# Altium project Project_1_Special_Strings.PrjPcb
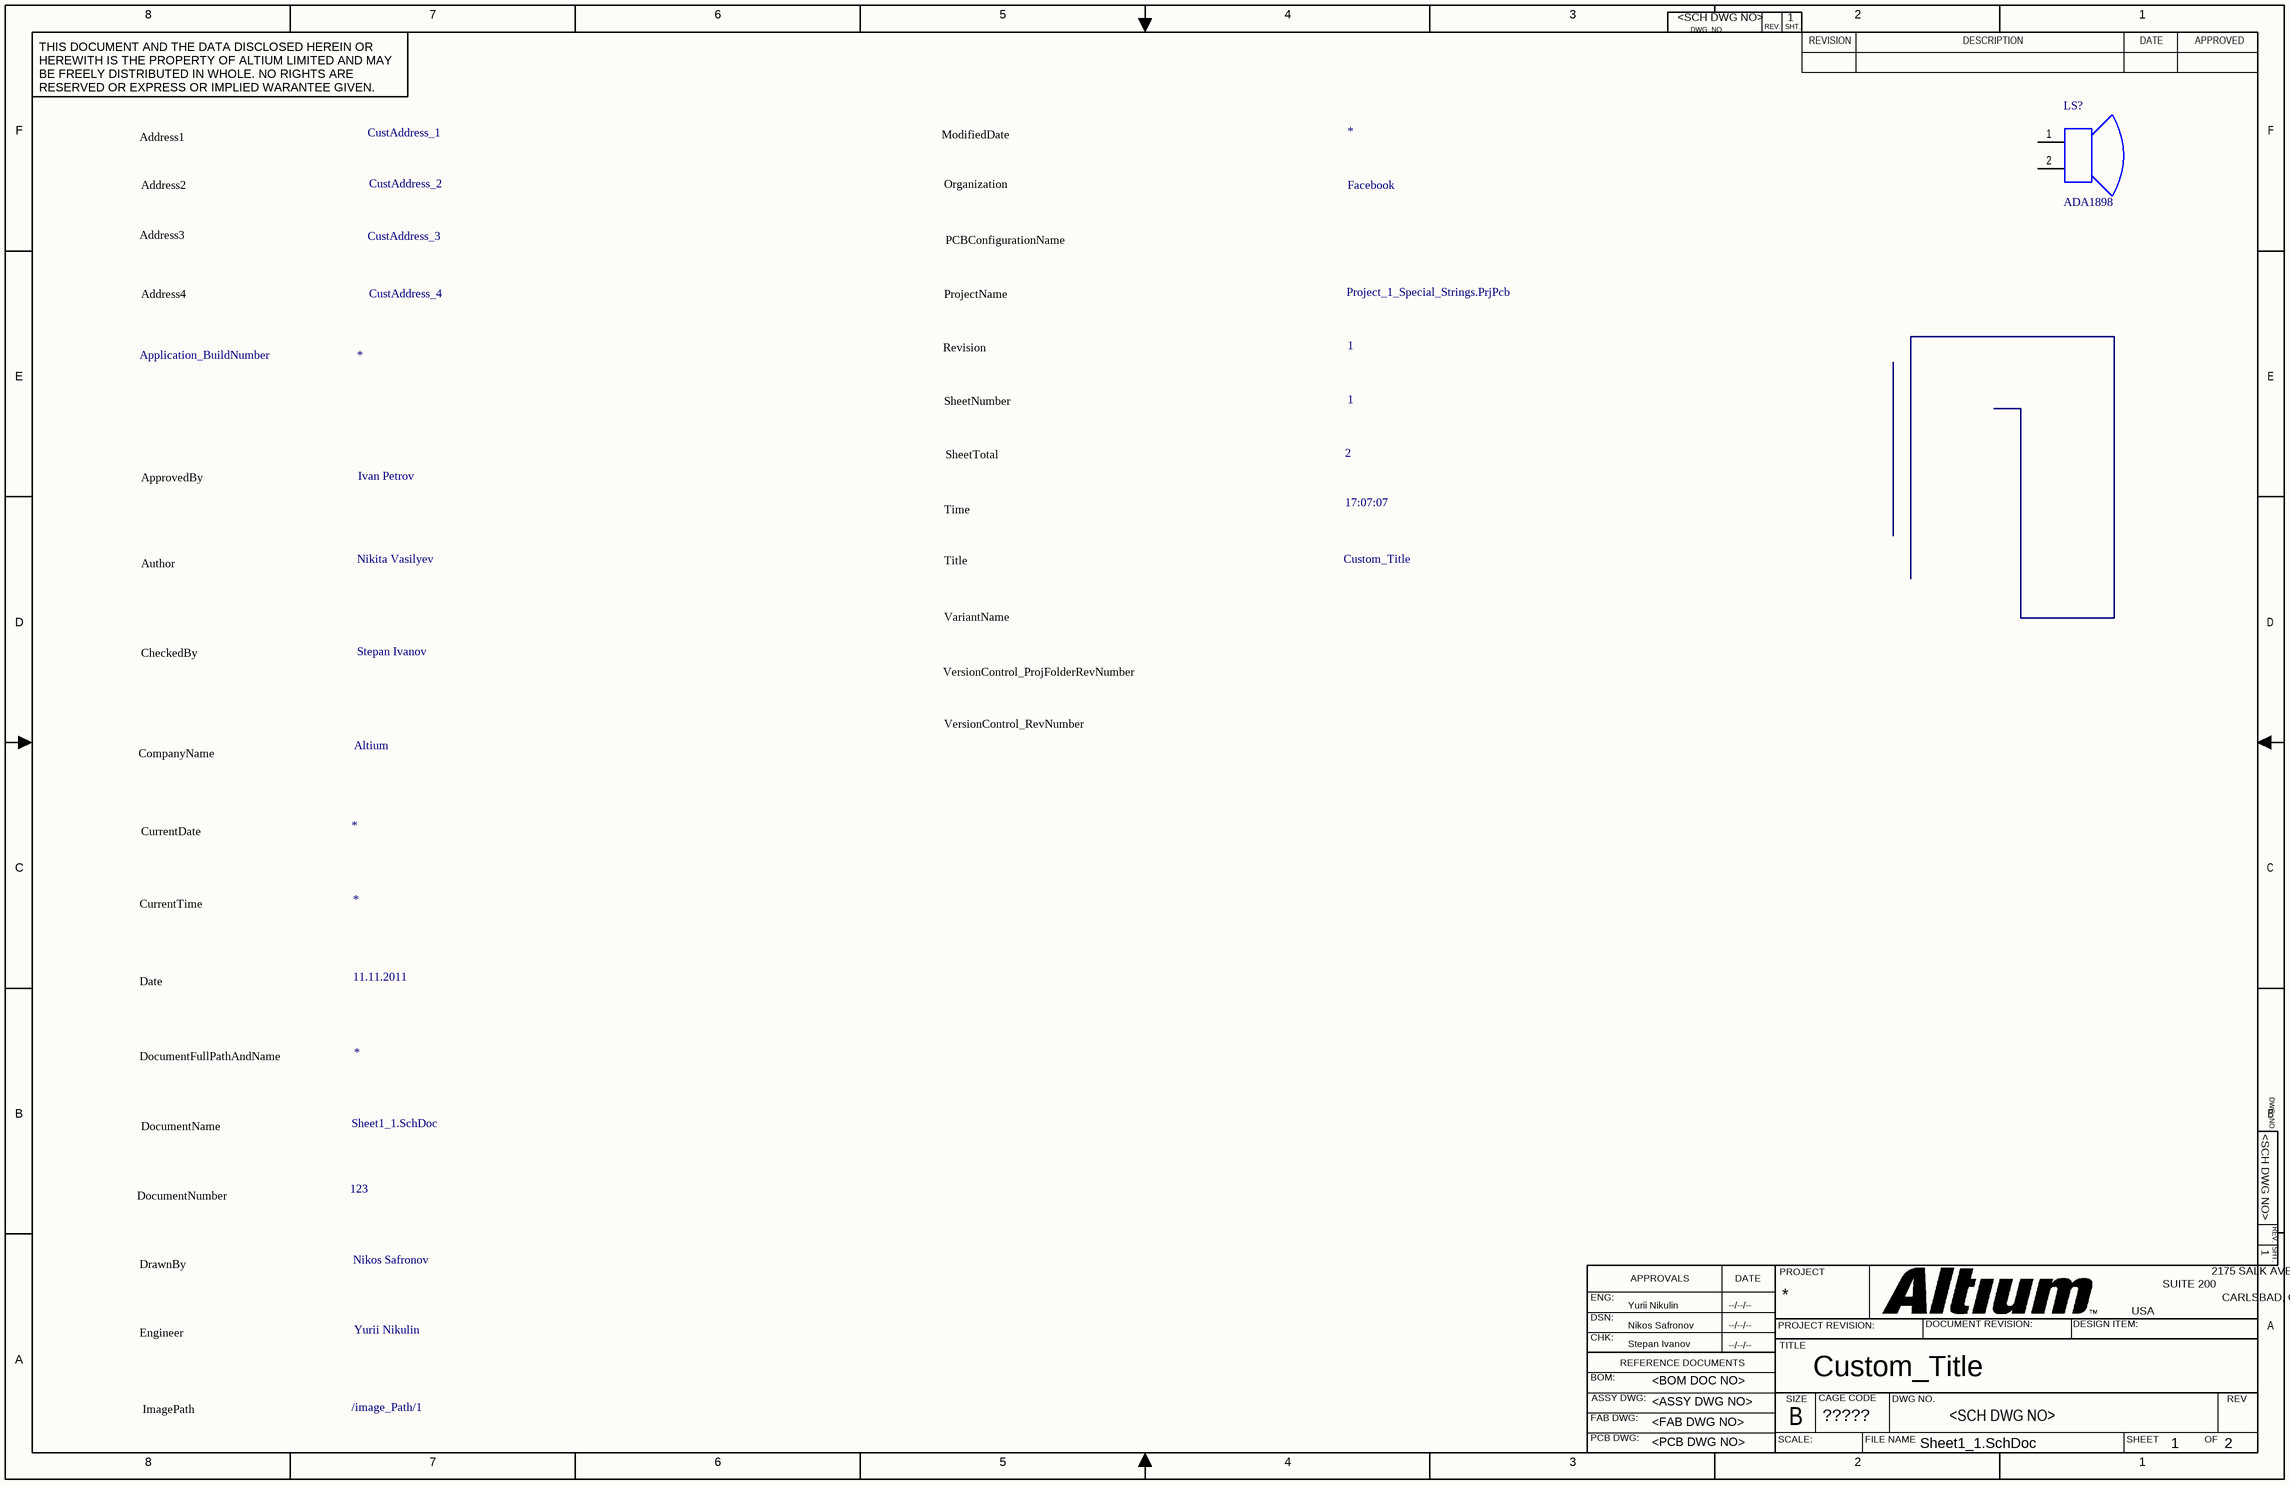
[diagram p0: Sheet1_1.SchDoc]
CAGE_CODE: ?????; CONTRACT_NUMBER: <CONTRACT NO>; DOC_NO_ASSY_DWG: <ASSY DWG NO>; DOC_NO_BOM: <BOM DOC NO>; DOC_NO_FAB_DWG: <FAB DWG NO>; DOC_NO_SCH_DWG: <SCH DWG NO>; PCB_2_DEC_TOL: +/-.01; PCB_3_DEC_TOL: +/-.010; PCB_ANG_TOL: +/-1/2; PCB_ASSEMBLY_NO: <PCB ASSY NO>; PCB_CHECKER: - -----; PCB_CHECKER_APP_DATE: --/--/----; PCB_DESIGNER: - -----; PCB_DESIGNER_APP_DATE: --/--/----; PCB_DWG_NO: <PCB DWG NO>; PCB_ENGINEER: - -----; PCB_ENGINEER_APP_DATE: --/--/----; PCB_PART_NUMBER: <PCB PN>; PCB_REV: A; SCH_REV: A
1 sheet, 1 parts. Net scope: global (net labels, ports and power ports of the same name join across sheets).
Board file: PCB1_1.PcbDoc

## Sheet Sheet1_1.SchDoc: Custom_Title
size 431 x 279 mm; Date: 11.11.2011; ApprovedBy: Ivan Petrov; CheckedBy: Stepan Ivanov; Author: Nikita Vasilyev; CompanyName: Altium; DrawnBy: Nikos Safronov; Engineer: Yurii Nikulin; Organization: Facebook; Address1: CustAddress_1; Address2: CustAddress_2; Address3: CustAddress_3; Address4: CustAddress_4; DocumentNumber: 123; Revision: 1; SheetNumber: 1; SheetTotal: 2; ENG_APP_DATE: --/--/--; DSN_APP_DATE: --/--/--; CHK_APP_DATE: --/--/--; Time: 17:07:07; ImagePath: /image_Path/1

### Parts
LS?  ADA1898  [ADAI-ADA1898]

### Nets

Not connected (* = marked no-connect by the designer): LS? 1(+) 2(-)

### Notes on the sheet
- Address1
- ModifiedDate
- Address2
- Organization
- Address3
- Address4
- ProjectName
- PCBConfigurationName
- Application_BuildNumber
- Revision
- SheetNumber
- ApprovedBy
- SheetTotal
- Author
- Time
- Title
- VariantName
- CheckedBy
- VersionControl_ProjFolderRevNumber
- CompanyName
- VersionControl_RevNumber
- CurrentDate
- CurrentTime
- Date
- DocumentFullPathAndName
- DocumentName
- DocumentNumber
- DrawnBy
- Engineer
- ImagePath
- 8
- 7
- 6
- 5
- 4
- 3
- DWG. NO.
- REV.
- SHT.
- 2
- 1
- THIS DOCUMENT AND THE DATA DISCLOSED HEREIN OR HEREWITH IS THE PROPERTY OF ALTIUM LIMITED AND MAY BE FREELY DISTRIBUTED IN WHOLE. NO RIGHTS ARE RESERVED OR EXPRESS OR IMPLIED WARANTEE GIVEN.
- REVISION
- DESCRIPTION
- DATE
- APPROVED
- F
- E
- D
- C
- B
- ENG:
- APPROVALS
- PROJECT
- SUITE 200
- 2175 SALK AVENUE
- CARLSBAD, CA 92008
- A
- DSN:
- CHK:
- REFERENCE DOCUMENTS
- PROJECT REVISION:
- TITLE
- DOCUMENT REVISION:
- DESIGN ITEM:
- USA
- BOM:
- FAB DWG:
- PCB DWG:
- ASSY DWG:
- SCALE:
- SIZE
- CAGE CODE
- FILE NAME
- DWG NO.
- SHEET
- OF
- REV

### Library data of the parts
LS? = CMP-00027-00000-1: Mini Speaker, 8 Ohm, 0.2 Wmax, -10 to 40 degC, 2-Pin THD, RoHS; Manufacturer: Adafruit Industries; Mounting Technology: TH; Datasheet URL: https://cdn-shop.adafruit.com/datasheets/P1898.pdf; Package Description: 2-Pin Through Hole Device, Dia 29.3 mm, Pitch 15 mm; Case/Package: ADA1898; Package Reference: ADA1898; Datasheet Version: Mar-14; Manufacturer URL: https://www.adafruit.com/; RoHS Compliant: Unknown

## Assembly variants
Variant of Project_1_Special_Strings: alternate parts LS? -> CMP-00027-00001-1